# Altium schematic sheet Cover.SchDoc
size A4; DrawnBy: İsmet Akalın; SheetNumber: 1; SheetTotal: 7
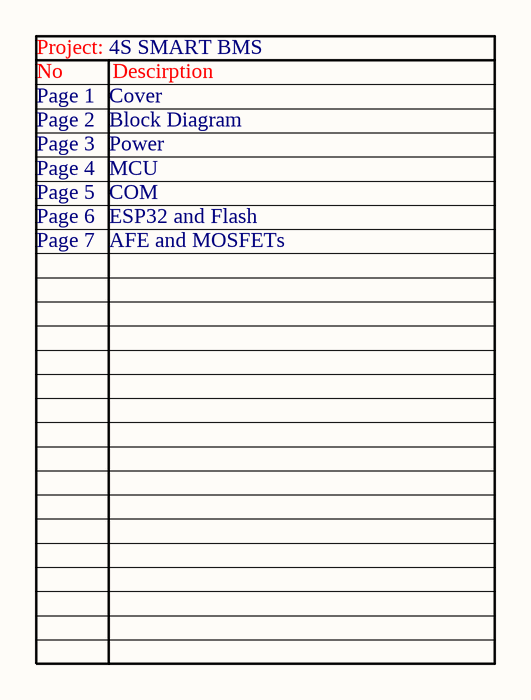
[diagram p0: Cover.SchDoc]

## Notes on the sheet
- No         Descirption
- Project:
- 4S SMART BMS
- Page 1
- Page 2
- Page 3
- Page 4
- Page 5
- Cover
- Block Diagram
- Power
- MCU
- COM
- Page 6
- Page 7
- ESP32 and Flash
- AFE and MOSFETs